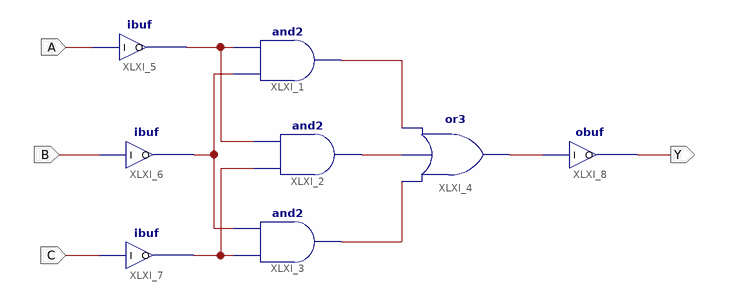
[diagram p0: schematic sheet 1]
// Xilinx ISE schematic Mayority_Detector.sch (spartan6) as structural Verilog: 8 symbols, 4 ports
module Mayority_Detector (
  input  A,
  input  B,
  input  C,
  output Y
);

  wire XLXN_1, XLXN_2, XLXN_3, XLXN_6, XLXN_8, XLXN_9, XLXN_10;

  and XLXI_1 (XLXN_1, XLXN_6, XLXN_8);
  and XLXI_2 (XLXN_3, XLXN_9, XLXN_8);
  and XLXI_3 (XLXN_2, XLXN_9, XLXN_6);
  or XLXI_4 (XLXN_10, XLXN_2, XLXN_3, XLXN_1);
  ibuf XLXI_5 (.I(A), .O(XLXN_8));
  ibuf XLXI_6 (.I(B), .O(XLXN_6));
  ibuf XLXI_7 (.I(C), .O(XLXN_9));
  obuf XLXI_8 (.I(XLXN_10), .O(Y));

  // Notes on the sheet:
  //   LOC on signal A = V9
  //   LOC on signal B = T9
  //   LOC on signal C = T10
  //   LOC on signal Y = U16
endmodule
